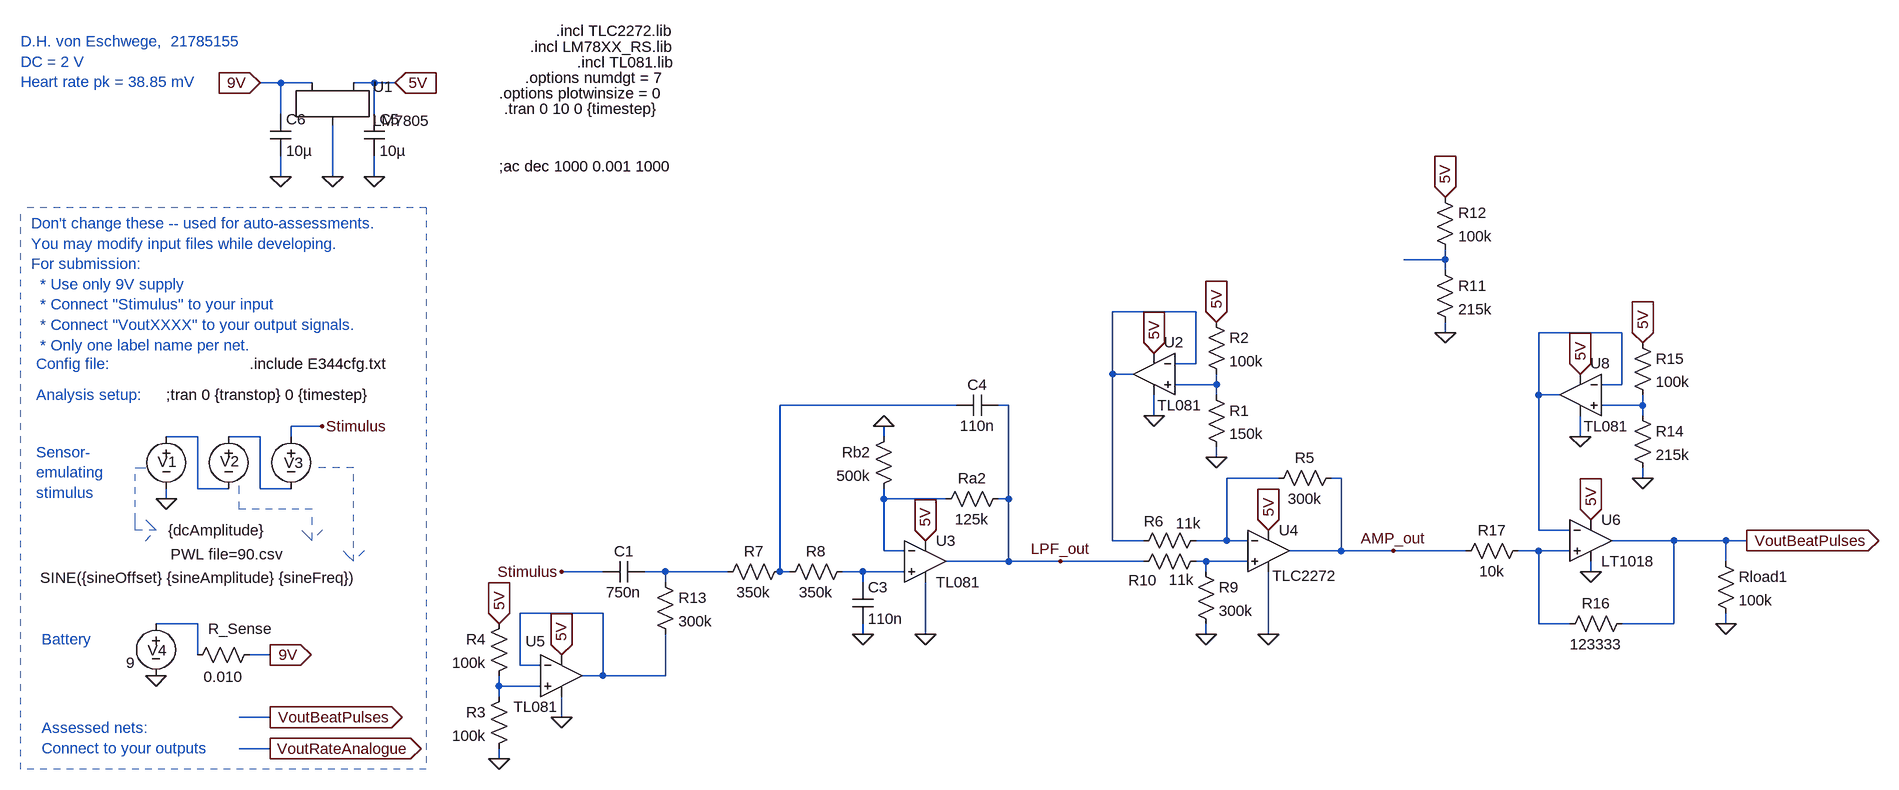
[diagram p0: schematic X_exp.asc]
X_exp.asc, the LTspice schematic file:
Version 4
SHEET 1 1824 680
WIRE -1904 -1600 -1936 -1600
WIRE -1856 -1600 -1904 -1600
WIRE -1760 -1600 -1792 -1600
WIRE -1728 -1600 -1760 -1600
WIRE -1904 -1552 -1904 -1600
WIRE -1760 -1552 -1760 -1600
WIRE -1904 -1456 -1904 -1488
WIRE -1824 -1456 -1824 -1536
WIRE -1760 -1456 -1760 -1488
WIRE -112 -1328 -112 -1344
WIRE -112 -1328 -176 -1328
WIRE -112 -1312 -112 -1328
WIRE -496 -1248 -624 -1248
WIRE -112 -1216 -112 -1232
WIRE 160 -1216 32 -1216
WIRE -496 -1168 -496 -1248
WIRE -496 -1168 -528 -1168
WIRE -624 -1152 -624 -1248
WIRE -592 -1152 -624 -1152
WIRE -464 -1136 -464 -1152
WIRE -464 -1136 -528 -1136
WIRE 160 -1136 160 -1216
WIRE 160 -1136 128 -1136
WIRE -464 -1120 -464 -1136
WIRE 32 -1120 32 -1216
WIRE 64 -1120 32 -1120
WIRE -864 -1104 -1136 -1104
WIRE -784 -1104 -800 -1104
WIRE 192 -1104 192 -1120
WIRE 192 -1104 128 -1104
WIRE -560 -1088 -560 -1120
WIRE 192 -1088 192 -1104
WIRE -1840 -1072 -1888 -1072
WIRE -2032 -1056 -2080 -1056
WIRE -1936 -1056 -1984 -1056
WIRE -1888 -1056 -1888 -1072
WIRE -976 -1056 -976 -1072
WIRE 96 -1056 96 -1088
WIRE -464 -1024 -464 -1040
WIRE -368 -992 -448 -992
WIRE -272 -992 -288 -992
WIRE 192 -992 192 -1008
WIRE -2032 -976 -2032 -1056
WIRE -1984 -976 -2032 -976
WIRE -1936 -976 -1936 -1056
WIRE -1888 -976 -1936 -976
WIRE -2080 -960 -2080 -976
WIRE -976 -960 -976 -976
WIRE -880 -960 -976 -960
WIRE -784 -960 -784 -1104
WIRE -784 -960 -800 -960
WIRE 32 -912 32 -1120
WIRE 80 -912 32 -912
WIRE -624 -896 -624 -1152
WIRE -576 -896 -624 -896
WIRE -448 -896 -448 -992
WIRE -448 -896 -496 -896
WIRE -416 -896 -448 -896
WIRE 240 -896 144 -896
WIRE 320 -896 240 -896
WIRE 352 -896 320 -896
WIRE -976 -880 -976 -960
WIRE -944 -880 -976 -880
WIRE -272 -880 -272 -992
WIRE -272 -880 -352 -880
WIRE -192 -880 -272 -880
WIRE -80 -880 -192 -880
WIRE 32 -880 0 -880
WIRE 80 -880 32 -880
WIRE -784 -864 -784 -960
WIRE -784 -864 -880 -864
WIRE -704 -864 -784 -864
WIRE -576 -864 -704 -864
WIRE -480 -864 -496 -864
WIRE -416 -864 -480 -864
WIRE 320 -864 320 -896
WIRE -1408 -848 -1472 -848
WIRE -1312 -848 -1344 -848
WIRE -1216 -848 -1312 -848
WIRE -1136 -848 -1136 -1104
WIRE -1120 -848 -1136 -848
WIRE -1008 -848 -1040 -848
WIRE -944 -848 -1008 -848
WIRE -480 -848 -480 -864
WIRE 112 -848 112 -864
WIRE -1312 -832 -1312 -848
WIRE -1008 -832 -1008 -848
WIRE -1408 -784 -1536 -784
WIRE -2032 -768 -2096 -768
WIRE 32 -768 32 -880
WIRE 80 -768 32 -768
WIRE 240 -768 240 -896
WIRE 240 -768 160 -768
WIRE 320 -768 320 -784
WIRE -1008 -752 -1008 -768
WIRE -912 -752 -912 -832
WIRE -480 -752 -480 -768
WIRE -384 -752 -384 -848
WIRE -2032 -720 -2032 -768
WIRE -1920 -720 -1952 -720
WIRE -1536 -704 -1536 -784
WIRE -1504 -704 -1536 -704
WIRE -1408 -688 -1408 -784
WIRE -1408 -688 -1440 -688
WIRE -1312 -688 -1312 -752
WIRE -1312 -688 -1408 -688
WIRE -1568 -672 -1568 -688
WIRE -1504 -672 -1568 -672
WIRE -1568 -656 -1568 -672
WIRE -1920 -624 -1968 -624
WIRE -1472 -624 -1472 -656
WIRE -1920 -576 -1968 -576
WIRE -1568 -560 -1568 -576
FLAG -2080 -960 0
FLAG -1840 -1072 Stimulus
FLAG -1920 -720 9V
IOPIN -1920 -720 Out
FLAG -2096 -688 0
FLAG -1920 -624 VoutBeatPulses
IOPIN -1920 -624 Out
FLAG -1920 -576 VoutRateAnalogue
IOPIN -1920 -576 Out
FLAG -1824 -1456 0
FLAG -912 -752 0
FLAG -1008 -752 0
FLAG -976 -1072 0
FLAG -1936 -1600 9V
IOPIN -1936 -1600 In
FLAG -1904 -1456 0
FLAG -1760 -1456 0
FLAG -1728 -1600 5V
IOPIN -1728 -1600 In
FLAG -912 -896 5V
IOPIN -912 -896 In
FLAG 320 -768 0
FLAG -384 -752 0
FLAG -480 -752 0
FLAG -704 -864 LPF_out
FLAG -464 -1024 0
FLAG -464 -1232 5V
IOPIN -464 -1232 In
FLAG -560 -1088 0
FLAG -384 -912 5V
IOPIN -384 -912 In
FLAG -560 -1184 5V
IOPIN -560 -1184 In
FLAG 352 -896 VoutBeatPulses
IOPIN 352 -896 Out
FLAG -112 -1216 0
FLAG -112 -1424 5V
IOPIN -112 -1424 In
FLAG 112 -928 5V
IOPIN 112 -928 In
FLAG 112 -848 0
FLAG -1568 -560 0
FLAG -1568 -768 5V
IOPIN -1568 -768 In
FLAG -1472 -624 0
FLAG -1472 -720 5V
IOPIN -1472 -720 In
FLAG -1472 -848 Stimulus
FLAG -192 -880 AMP_out
FLAG 192 -992 0
FLAG 192 -1200 5V
IOPIN 192 -1200 In
FLAG 96 -1056 0
FLAG 96 -1152 5V
IOPIN 96 -1152 In
SYMBOL voltage -1984 -1072 R0
WINDOW 123 0 0 Left 0
WINDOW 39 0 0 Left 0
WINDOW 3 -89 197 Left 2
WINDOW 0 -13 54 Left 2
SYMATTR Value PWL file=90.csv
SYMATTR InstName V2
SYMBOL voltage -1888 -1072 R0
WINDOW 123 24 44 Left 2
WINDOW 39 0 0 Left 0
WINDOW 3 -386 233 Left 2
WINDOW 0 -11 56 Left 2
SYMATTR Value SINE({sineOffset} {sineAmplitude} {sineFreq})
SYMATTR InstName V3
SYMBOL voltage -2080 -1072 R0
WINDOW 123 0 0 Left 0
WINDOW 39 0 0 Left 0
WINDOW 3 3 160 Left 2
WINDOW 0 -13 55 Left 2
SYMATTR Value {dcAmplitude}
SYMATTR InstName V1
SYMBOL voltage -2096 -784 R0
WINDOW 123 24 44 Left 2
WINDOW 39 0 0 Left 0
WINDOW 3 -46 76 Left 2
WINDOW 0 -13 57 Left 2
SYMATTR Value 9
SYMATTR InstName V4
SYMBOL res -1936 -736 R90
WINDOW 0 -9 30 VBottom 2
WINDOW 3 34 56 VTop 2
SYMATTR InstName R_Sense
SYMATTR Value 0.010
SYMBOL LM7805 -1824 -1584 R0
SYMATTR InstName U1
SYMBOL res -1120 -864 R90
WINDOW 0 0 56 VBottom 2
WINDOW 3 32 56 VTop 2
SYMATTR InstName R7
SYMATTR Value 350k
SYMBOL cap -1024 -832 R0
SYMATTR InstName C3
SYMATTR Value 110n
SYMBOL Opamps\\opamp2 -912 -928 R0
SYMATTR InstName U3
SYMATTR Value TL081
SYMBOL res -1024 -864 R90
WINDOW 0 0 56 VBottom 2
WINDOW 3 32 56 VTop 2
SYMATTR InstName R8
SYMATTR Value 350k
SYMBOL res -784 -976 R90
WINDOW 0 0 56 VBottom 2
WINDOW 3 32 56 VTop 2
SYMATTR InstName Ra2
SYMATTR Value 125k
SYMBOL res -960 -1072 M0
SYMATTR InstName Rb2
SYMATTR Value 500k
SYMBOL cap -800 -1120 R90
WINDOW 0 0 32 VBottom 2
WINDOW 3 32 32 VTop 2
SYMATTR InstName C4
SYMATTR Value 110n
SYMBOL cap -1776 -1552 R0
SYMATTR InstName C5
SYMATTR Value 10µ
SYMBOL cap -1920 -1552 R0
SYMATTR InstName C6
SYMATTR Value 10µ
SYMBOL res 304 -880 R0
SYMATTR InstName Rload1
SYMATTR Value 100k
SYMBOL res -272 -1008 R90
WINDOW 0 0 56 VBottom 2
WINDOW 3 32 56 VTop 2
SYMATTR InstName R5
SYMATTR Value 300k
SYMBOL res -480 -912 R90
WINDOW 0 2 80 VBottom 2
WINDOW 3 -26 27 VTop 2
SYMATTR InstName R6
SYMATTR Value 11k
SYMBOL Opamps\\opamp2 -384 -944 R0
WINDOW 3 6 102 Left 2
SYMATTR Value TLC2272
SYMATTR InstName U4
SYMBOL res -496 -864 R0
SYMATTR InstName R9
SYMATTR Value 300k
SYMBOL res -480 -880 R90
WINDOW 0 61 97 VBottom 2
WINDOW 3 29 38 VTop 2
SYMATTR InstName R10
SYMATTR Value 11k
SYMBOL res -480 -1136 R0
SYMATTR InstName R1
SYMATTR Value 150k
SYMBOL res -480 -1248 R0
SYMATTR InstName R2
SYMATTR Value 100k
SYMBOL Opamps\\opamp2 -560 -1216 M0
WINDOW 0 -46 15 Left 2
WINDOW 3 -74 112 Left 2
SYMATTR InstName U2
SYMATTR Value TL081
SYMBOL Comparators\\LT1018 112 -896 R0
SYMATTR InstName U6
SYMBOL res -128 -1328 R0
SYMATTR InstName R11
SYMATTR Value 215k
SYMBOL res -128 -1440 R0
SYMATTR InstName R12
SYMATTR Value 100k
SYMBOL cap -1344 -864 R90
WINDOW 0 0 32 VBottom 2
WINDOW 3 32 32 VTop 2
SYMATTR InstName C1
SYMATTR Value 750n
SYMBOL res -1552 -672 M0
SYMATTR InstName R3
SYMATTR Value 100k
SYMBOL res -1552 -784 M0
SYMATTR InstName R4
SYMATTR Value 100k
SYMBOL Opamps\\opamp2 -1472 -752 R0
WINDOW 0 -55 11 Left 2
WINDOW 3 -74 112 Left 2
SYMATTR InstName U5
SYMATTR Value TL081
SYMBOL res -1328 -848 R0
SYMATTR InstName R13
SYMATTR Value 300k
SYMBOL res 176 -1104 R0
SYMATTR InstName R14
SYMATTR Value 215k
SYMBOL res 176 -1216 R0
SYMATTR InstName R15
SYMATTR Value 100k
SYMBOL Opamps\\opamp2 96 -1184 M0
WINDOW 0 -46 15 Left 2
WINDOW 3 -74 112 Left 2
SYMATTR InstName U8
SYMATTR Value TL081
SYMBOL res 176 -784 R90
WINDOW 0 0 56 VBottom 2
WINDOW 3 32 56 VTop 2
SYMATTR InstName R16
SYMATTR Value 123333
SYMBOL res 16 -896 R90
WINDOW 0 0 56 VBottom 2
WINDOW 3 32 56 VTop 2
SYMATTR InstName R17
SYMATTR Value 10k
TEXT -2080 -1120 Left 2 !;tran 0 {transtop} 0 {timestep}
TEXT -1952 -1168 Left 2 !.include E344cfg.txt
TEXT -2288 -1384 Left 2 ;Don't change these -- used for auto-assessments.\nYou may modify input files while developing.\nFor submission: \n  * Use only 9V supply \n  * Connect "Stimulus" to your input\n  * Connect "VoutXXXX" to your output signals.\n  * Only one label name per net.
TEXT -2280 -1168 Left 2 ;Config file:
TEXT -2280 -1120 Left 2 ;Analysis setup:
TEXT -2272 -744 Left 2 ;Battery
TEXT -2280 -1032 Left 2 ;Sensor-\nemulating \nstimulus
TEXT -2272 -608 Left 2 ;Assessed nets:\nConnect to your outputs
TEXT -2304 -1664 Left 2 ;D.H. von Eschwege,  21785155\nDC = 2 V\nHeart rate pk = 38.85 mV
TEXT -1480 -1680 Left 2 !.incl TLC2272.lib
TEXT -1520 -1656 Left 2 !.incl LM78XX_RS.lib
TEXT -1448 -1632 Left 2 !.incl TL081.lib
TEXT -1528 -1608 Left 2 !.options numdgt = 7
TEXT -1568 -1584 Left 2 !.options plotwinsize = 0
TEXT -1568 -1472 Left 2 !;ac dec 1000 0.001 1000
TEXT -1560 -1560 Left 2 !.tran 0 10 0 {timestep}
LINE Normal -1792 -1008 -1856 -1008 2
LINE Normal -1792 -864 -1792 -1008 2
LINE Normal -1808 -880 -1792 -864 2
LINE Normal -1792 -864 -1808 -880 2
LINE Normal -1776 -880 -1792 -864 2
LINE Normal -2128 -1008 -2112 -1008 2
LINE Normal -2128 -928 -2128 -1008 2
LINE Normal -2128 -912 -2128 -928 2
LINE Normal -2096 -912 -2128 -912 2
LINE Normal -2112 -928 -2096 -912 2
LINE Normal -2096 -912 -2112 -928 2
LINE Normal -2112 -896 -2096 -912 2
LINE Normal -1968 -944 -1968 -992 2
LINE Normal -1856 -944 -1968 -944 2
LINE Normal -1856 -896 -1856 -944 2
LINE Normal -1872 -912 -1856 -896 2
LINE Normal -1856 -896 -1872 -912 2
LINE Normal -1840 -912 -1856 -896 2
LINE Normal -2304 -544 -2304 -1408 1
LINE Normal -1680 -1408 -1680 -544 1
LINE Normal -1680 -544 -2304 -544 1
LINE Normal -1680 -1408 -2304 -1408 1

The netlist it stands for:
* X_exp.asc
V2 N008 N007 PWL file=90.csv
V3 Stimulus N008 SINE({sineOffset} {sineAmplitude} {sineFreq})
V1 N007 0 {dcAmplitude}
V4 N016 0 9
R_Sense 9V N016 0.010
XU1 9V 0 5V LM7805
R7 N005 N013 350k
C3 N014 0 110n
XU3 N014 N010 5V 0 LPF_out TL081  ; pins In+ In- V+ V- OUT
R8 N014 N005 350k
Ra2 LPF_out N010 125k
Rb2 0 N010 500k
C4 LPF_out N005 110n
C5 5V 0 10µ
C6 9V 0 10µ
Rload1 VoutBeatPulses 0 100k
R5 AMP_out N009 300k
R6 N009 N002 11k
XU4 N012 N009 5V 0 AMP_out TLC2272  ; pins In+ In- V+ V- OUT
R9 N012 0 300k
R10 N012 LPF_out 11k
R1 N004 0 150k
R2 5V N004 100k
XU2 N004 N002 5V 0 N002 TL081  ; pins In+ In- V+ V- OUT
XU6 N011 N003 5V 0 VoutBeatPulses LT1018  ; pins In+ In- V+ V- OUT
R11 N001 0 215k
R12 5V N001 100k
C1 N013 Stimulus 750n
R3 N017 0 100k
R4 5V N017 100k
XU5 N017 N015 5V 0 N015 TL081  ; pins In+ In- V+ V- OUT
R13 N013 N015 300k
R14 N006 0 215k
R15 5V N006 100k
XU8 N006 N003 5V 0 N003 TL081  ; pins In+ In- V+ V- OUT
R16 VoutBeatPulses N011 123333
R17 N011 AMP_out 10k
;tran 0 {transtop} 0 {timestep}
.include E344cfg.txt
* Don't change these -- used for auto-assessments.
* You may modify input files while developing.
* For submission:
*   * Use only 9V supply
*   * Connect "Stimulus" to your input
*   * Connect "VoutXXXX" to your output signals.
*   * Only one label name per net.
* Config file:
* Analysis setup:
* Battery
* Sensor-
* emulating
* stimulus
* Assessed nets:
* Connect to your outputs
* D.H. von Eschwege,  21785155
* DC = 2 V
* Heart rate pk = 38.85 mV
.incl TLC2272.lib
.incl LM78XX_RS.lib
.incl TL081.lib
.options numdgt = 7
.options plotwinsize = 0
;ac dec 1000 0.001 1000
.tran 0 10 0 {timestep}
.lib LTC1.lib
.backanno
.end